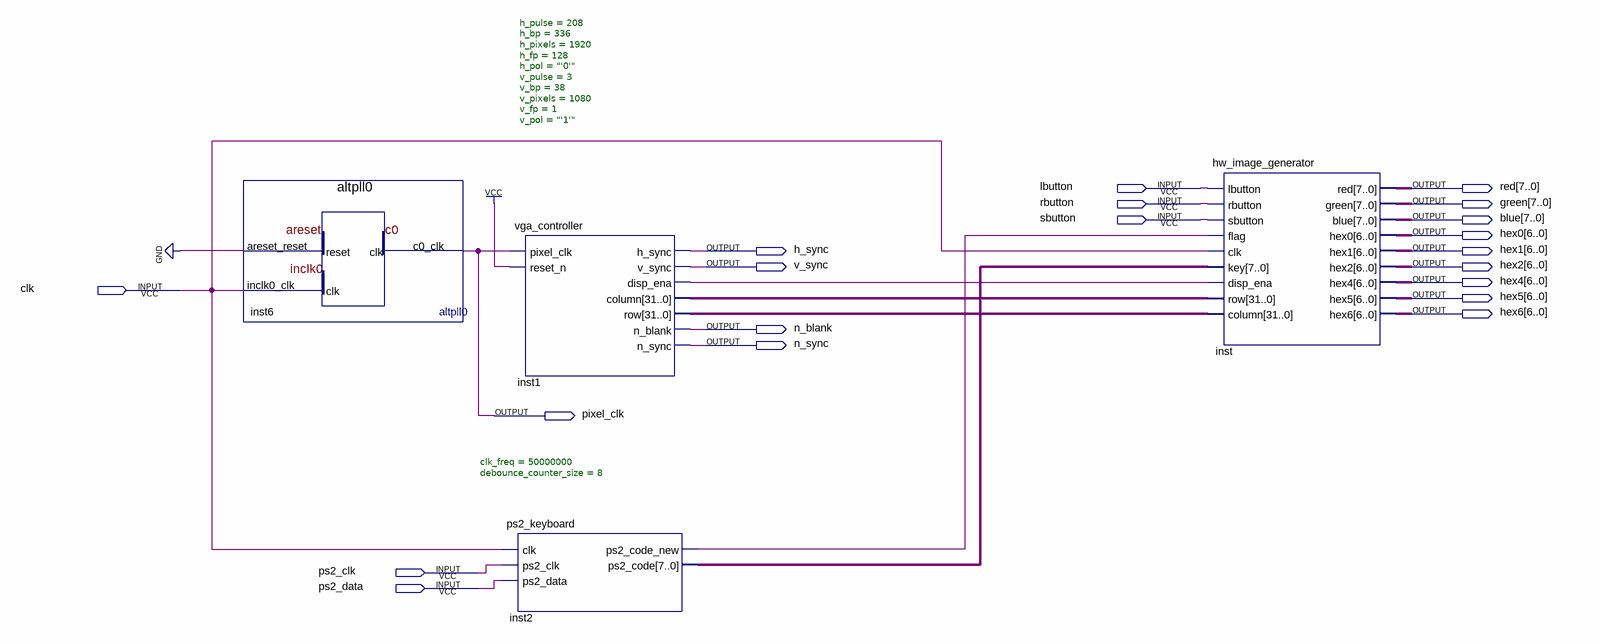
[diagram p0: schematic sheet]
// Quartus schematic game.bdf as structural Verilog: 4 symbols, 20 pins
module game (
  input  lbutton,
  input  rbutton,
  input  sbutton,
  input  clk,
  input  ps2_clk,
  input  ps2_data,
  output [7:0] red,
  output [7:0] green,
  output [7:0] blue,
  output [6:0] hex0,
  output h_sync,
  output [6:0] hex1,
  output v_sync,
  output [6:0] hex2,
  output [6:0] hex4,
  output [6:0] hex5,
  output [6:0] hex6,
  output n_blank,
  output n_sync,
  output pixel_clk
);

  wire inst1_disp_ena, inst2_ps2_code_new;
  wire [7:0] inst2_ps2_code;
  wire [31:0] inst1_column, inst1_row;

  altpll0 inst6 (.areset_reset(1'b0), .inclk0_clk(clk), .c0_clk(pixel_clk));
  vga_controller #(.h_pulse(208), .h_bp(336), .h_pixels(1920), .h_fp(128), .h_pol("'0'"), .v_pulse(3), .v_bp(38), .v_pixels(1080), .v_fp(1), .v_pol("'1'")) inst1 (
    .pixel_clk(pixel_clk), .reset_n(1'b1), .h_sync(h_sync), .v_sync(v_sync), .disp_ena(inst1_disp_ena),
    .column(inst1_column), .row(inst1_row), .n_blank(n_blank), .n_sync(n_sync));
  ps2_keyboard #(.clk_freq(50000000), .debounce_counter_size(8)) inst2 (
    .clk(clk), .ps2_clk(ps2_clk), .ps2_data(ps2_data), .ps2_code_new(inst2_ps2_code_new),
    .ps2_code(inst2_ps2_code));
  hw_image_generator inst (
    .lbutton(lbutton), .rbutton(rbutton), .sbutton(sbutton), .flag(inst2_ps2_code_new), .clk(clk),
    .key(inst2_ps2_code), .disp_ena(inst1_disp_ena), .row(inst1_column), .column(inst1_row), .red(red),
    .green(green), .blue(blue), .hex0(hex0), .hex1(hex1), .hex2(hex2), .hex4(hex4), .hex5(hex5), .hex6(hex6));
endmodule
